# Altium schematic sheet U_Disk.SchDoc
size A4
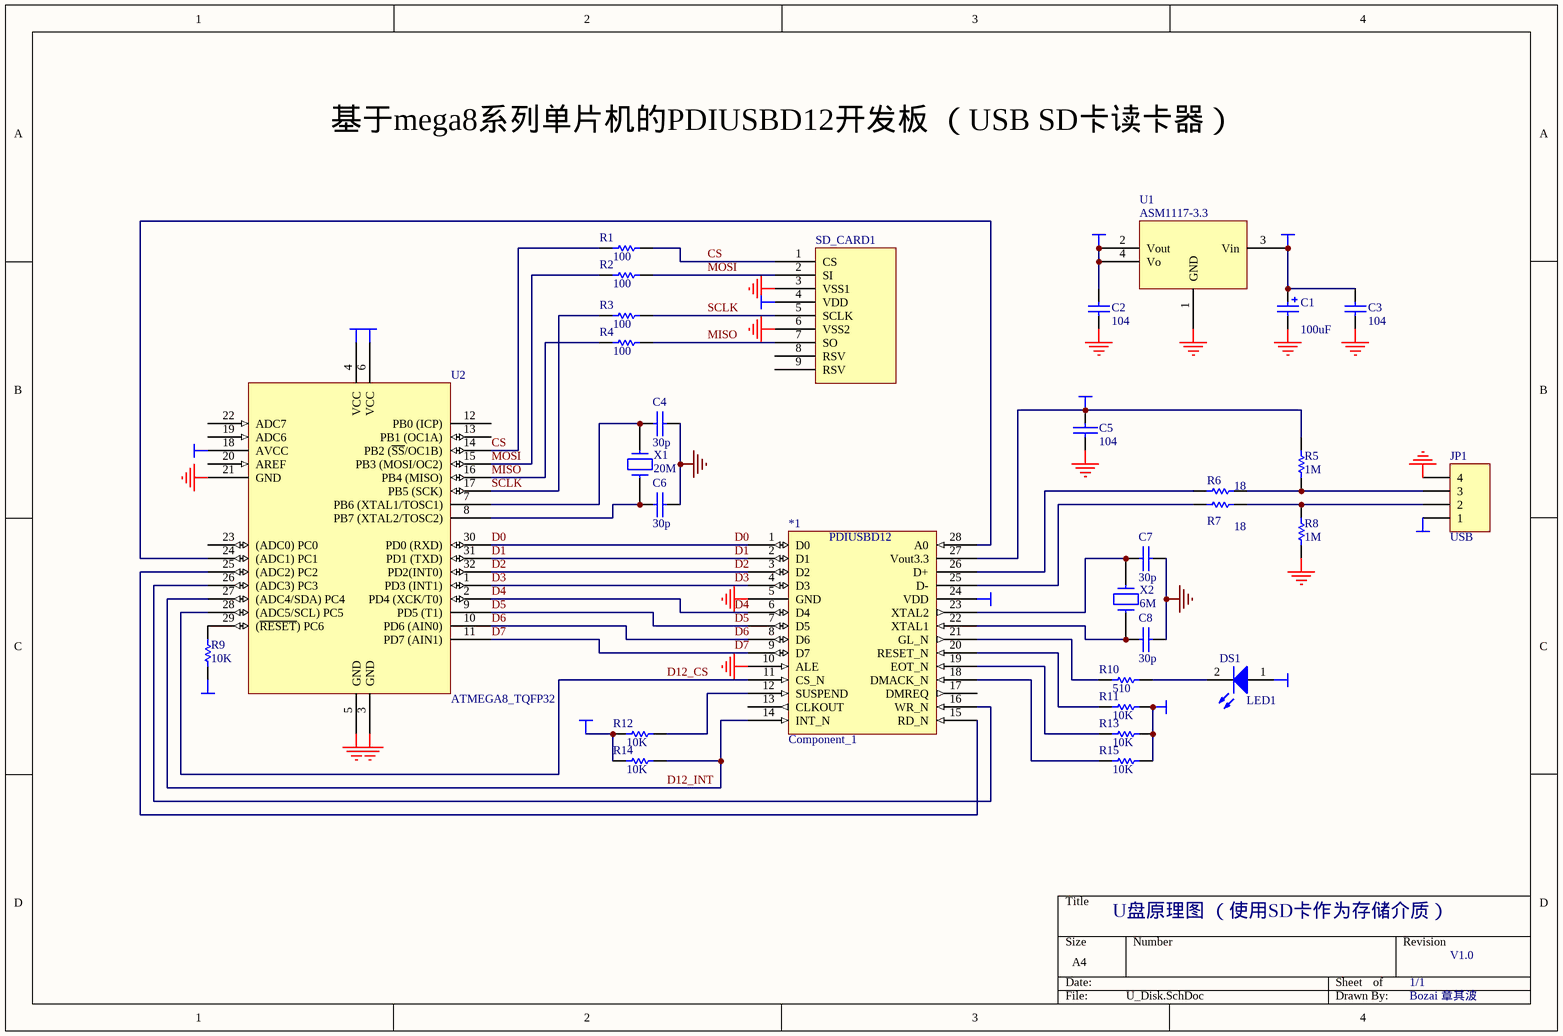
[diagram p0: U_Disk.SchDoc]

## Parts
*1  Component_1
C1  value 100uF  [RB7.6-15]  (hidden comment: Cap Pol1)
C2  value 104  [RAD-0.3]  (hidden comment: Cap)
C3  value 104  [RAD-0.3]  (hidden comment: Cap)
C4  30p  [0805]
C5  104  [0805]
C6  30p  [0805]
C7  30p  [0805]
C8  30p  [0805]
DS1  LED1  [LED-1]
JP1  USB  [HDR1X4]
R1  value 100  [AXIAL-0.3]  (hidden comment: Res1)
R2  value 100  [AXIAL-0.3]  (hidden comment: Res1)
R3  value 100  [AXIAL-0.3]  (hidden comment: Res1)
R4  value 100  [AXIAL-0.3]  (hidden comment: Res1)
R5  value 1M  [AXIAL-0.3]  (hidden comment: Res1)
R6  value 18  [AXIAL-0.3]  (hidden comment: Res1)
R7  value 18  [AXIAL-0.3]  (hidden comment: Res1)
R8  value 1M  [AXIAL-0.3]  (hidden comment: Res1)
R9  value 10K  [AXIAL-0.3]  (hidden comment: Res1)
R10  value 510  [AXIAL-0.3]  (hidden comment: Res1)
R11  value 10K  [AXIAL-0.3]  (hidden comment: Res1)
R12  value 10K  [AXIAL-0.3]  (hidden comment: Res1)
R13  value 10K  [AXIAL-0.3]  (hidden comment: Res1)
R14  value 10K  [AXIAL-0.3]  (hidden comment: Res1)
R15  value 10K  [AXIAL-0.3]  (hidden comment: Res1)
SD_CARD1  (no value)  [SD_CON]
U1  ASM1117-3.3  [SOT223]
U2  ATMEGA8_TQFP32  [DIP-28]
X1  20M  [CRYSTAL]
X2  6M  [CRYSTAL]

## Nets
GND: *1.5(GND) *1.10(ALE) C1.2 C2.1 C3.1 C4.2 C5.1 C6.2 C7.2 C8.2 JP1.4 R8.2 SD_CARD1.3(VSS1) SD_CARD1.6(VSS2) U1.1(GND) U2.3(GND) U2.5(GND) U2.21(GND)
VCC: *1.24(VDD) *1.27(Vout3.3) C2.2 C5.2 DS1.1(A) R5.1 R9.2 R11.1 R12.2 R13.1 R14.2 R15.1 SD_CARD1.4(VDD) U1.2(Vout) U1.4(Vo) U2.4(VCC) U2.6(VCC) U2.18(AVCC)
VCC_USB: C1.1 C3.2 JP1.1 U1.3(Vin)
CS: R1.1 R1.2 SD_CARD1.1(CS) U2.14(PB2_(~{SS}/OC1B))
D0: *1.1(D0) U2.30(PD0_(RXD))
D1: *1.2(D1) U2.31(PD1_(TXD))
D2: *1.3(D2) U2.32(PD2(INT0))
D3: *1.4(D3) U2.1(PD3_(INT1))
D4: *1.6(D4) U2.2(PD4_(XCK/T0))
D5: *1.7(D5) U2.9(PD5_(T1))
D6: *1.8(D6) U2.10(PD6_(AIN0))
D7: *1.9(D7) U2.11(PD7_(AIN1))
D12_CS: *1.11(CS_N) U2.28((ADC5/SCL)_PC5)
D12_INT: *1.14(INT_N) R14.1 U2.27((ADC4/SDA)_PC4)
MISO: R4.1 R4.2 SD_CARD1.7(SO) U2.16(PB4_(MISO))
MOSI: R2.1 R2.2 SD_CARD1.2(SI) U2.15(PB3_(MOSI/OC2))
SCLK: R3.1 R3.2 SD_CARD1.5(SCLK) U2.17(PB5_(SCK))
Net*1_12: *1.12(SUSPEND) R12.1
Net*1_15: *1.15(RD_N) U2.25((ADC2)_PC2)
Net*1_16: *1.16(WR_N) U2.26((ADC3)_PC3)
Net*1_18: *1.18(DMACK_N) R15.2
Net*1_19: *1.19(EOT_N) R13.2
Net*1_20: *1.20(RESET_N) R11.2
Net*1_21: *1.21(GL_N) R10.2
Net*1_22: *1.22(XTAL1) C8.1 X2.2
Net*1_23: *1.23(XTAL2) C7.1 X2.1
Net*1_25: *1.25(D-) R7.1
Net*1_26: *1.26(D+) R6.1
Net*1_28: *1.28(A0) U2.24((ADC1)_PC1)
NetC4_1: C4.1 U2.7(PB6_(XTAL1/TOSC1)) X1.1
NetC6_1: C6.1 U2.8(PB7_(XTAL2/TOSC2)) X1.2
NetDS1_2: DS1.2(K) R10.1
NetJP1_2: JP1.2 R7.2 R8.1
NetJP1_3: JP1.3 R5.2 R6.2
NetR9_1: R9.1 U2.29((~{RESET})_PC6)

Not connected (* = marked no-connect by the designer): *1 13(CLKOUT) 17(DMREQ); SD_CARD1 8(RSV) 9(RSV); U2 12(PB0_(ICP)) 13(PB1_(OC1A)) 19(ADC6) 20(AREF) 22(ADC7) 23((ADC0)_PC0)

## Notes on the sheet
- 基于mega8系列单片机的PDIUSBD12开发板 （USB SD卡读卡器）
- U盘原理图 （使用SD卡作为存储介质）
- 1/1
- V1.0
- Bozai 章其波
- (in symbol Component_1) PDIUSBD12

## Library data of the parts
C1 = Cap Pol1: Polarized Capacitor (Radial); Manufacturer: Generic Components; Class: Passive; Published: 08/06/2000; Publisher: Altium Hobart Technology Centre; SubClass: Capacitor
C2 C3 = Cap: Capacitor; Manufacturer: Generic Components; Class: Passive; Published: 08/06/2000; Publisher: Altium Hobart Technology Centre; SubClass: Capacitor
C4-C8 = CAP: Capacitor
DS1 = LED1: Typical RED GaAs LED; Manufacturer: Generic Components; Class: Optoelectronic; Published: 08/06/2000; Publisher: Altium Hobart Technology Centre; SubClass: LED
JP1 = Header 4: Header, 4-Pin; Manufacturer: Generic Components; Class: Connector
R1-R15 = Res1: Resistor; Manufacturer: Generic Components; Class: Passive; Published: 08/06/2000; Publisher: Altium Hobart Technology Centre; SubClass: Resistor
SD_CARD1 = SD_SPI
U1 = LM1084
U2 = ATMEGA8_TQFP32: Atmel Microcontroller - Library created by carel..  <www.mpfreezone.com>
X1 X2 = CRYSTAL